# Altium schematic sheet MC1617.SchDoc
size 999 x 599 mm; SheetNumber: 2; SheetTotal: 2; SPICEModelCacheVUJZUAXU: <root> / <DocumentId>VUJZUAXU</DocumentId> / </root>
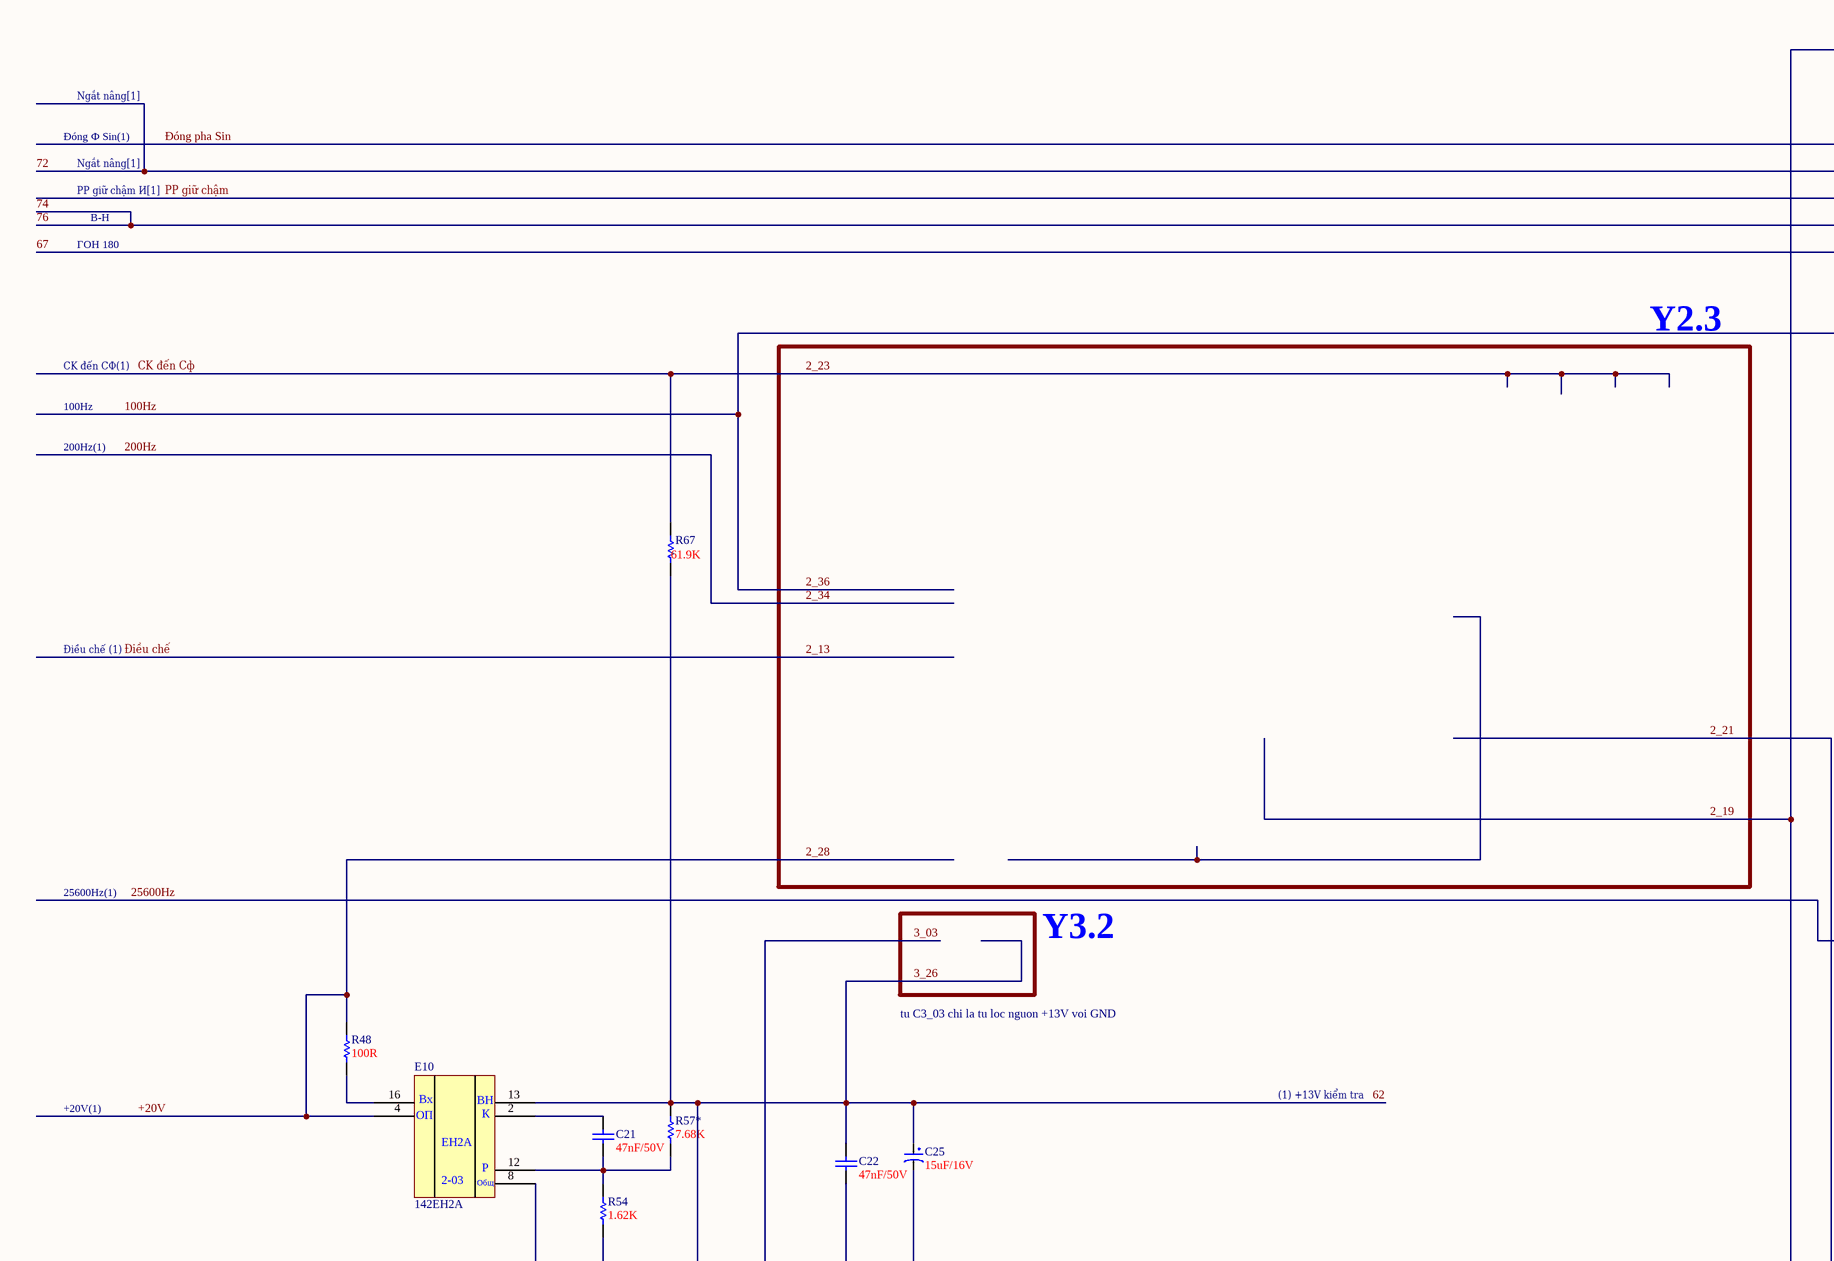
[diagram p0: MC1617.SchDoc, top left]
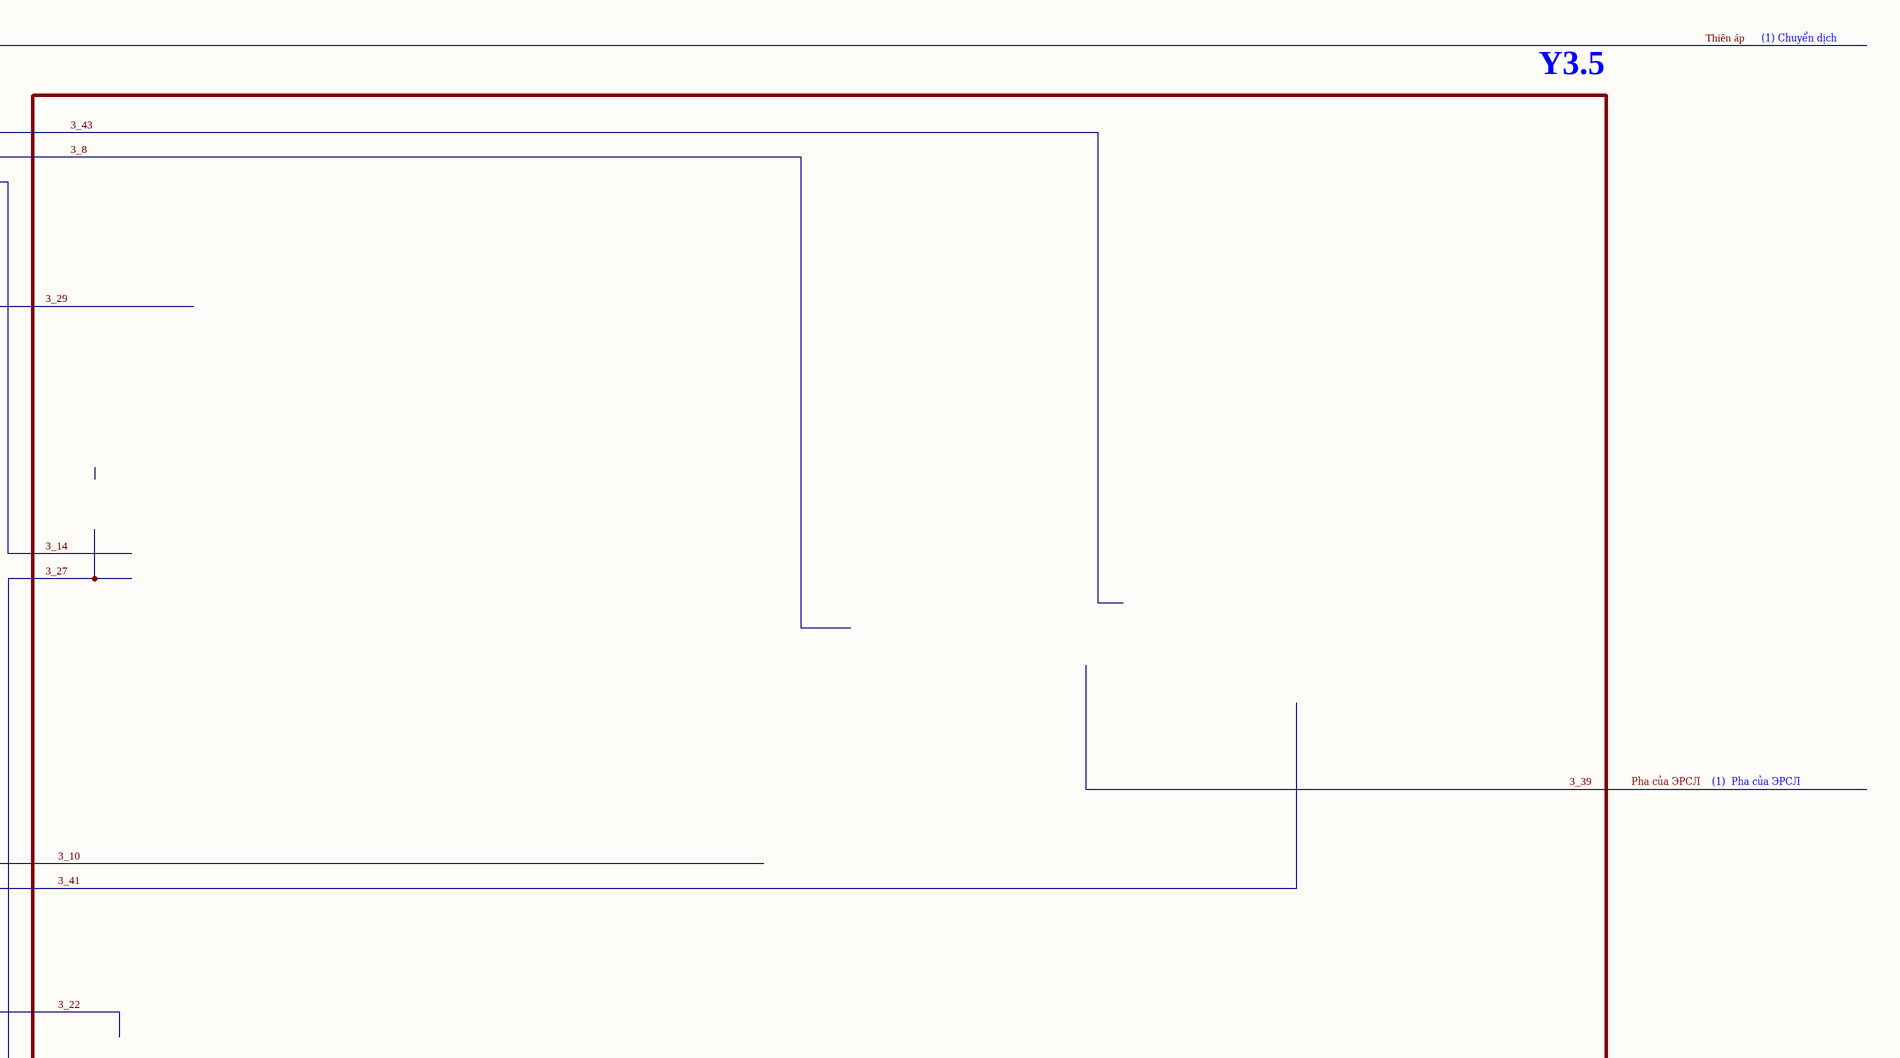
[diagram p1: MC1617.SchDoc, top right]
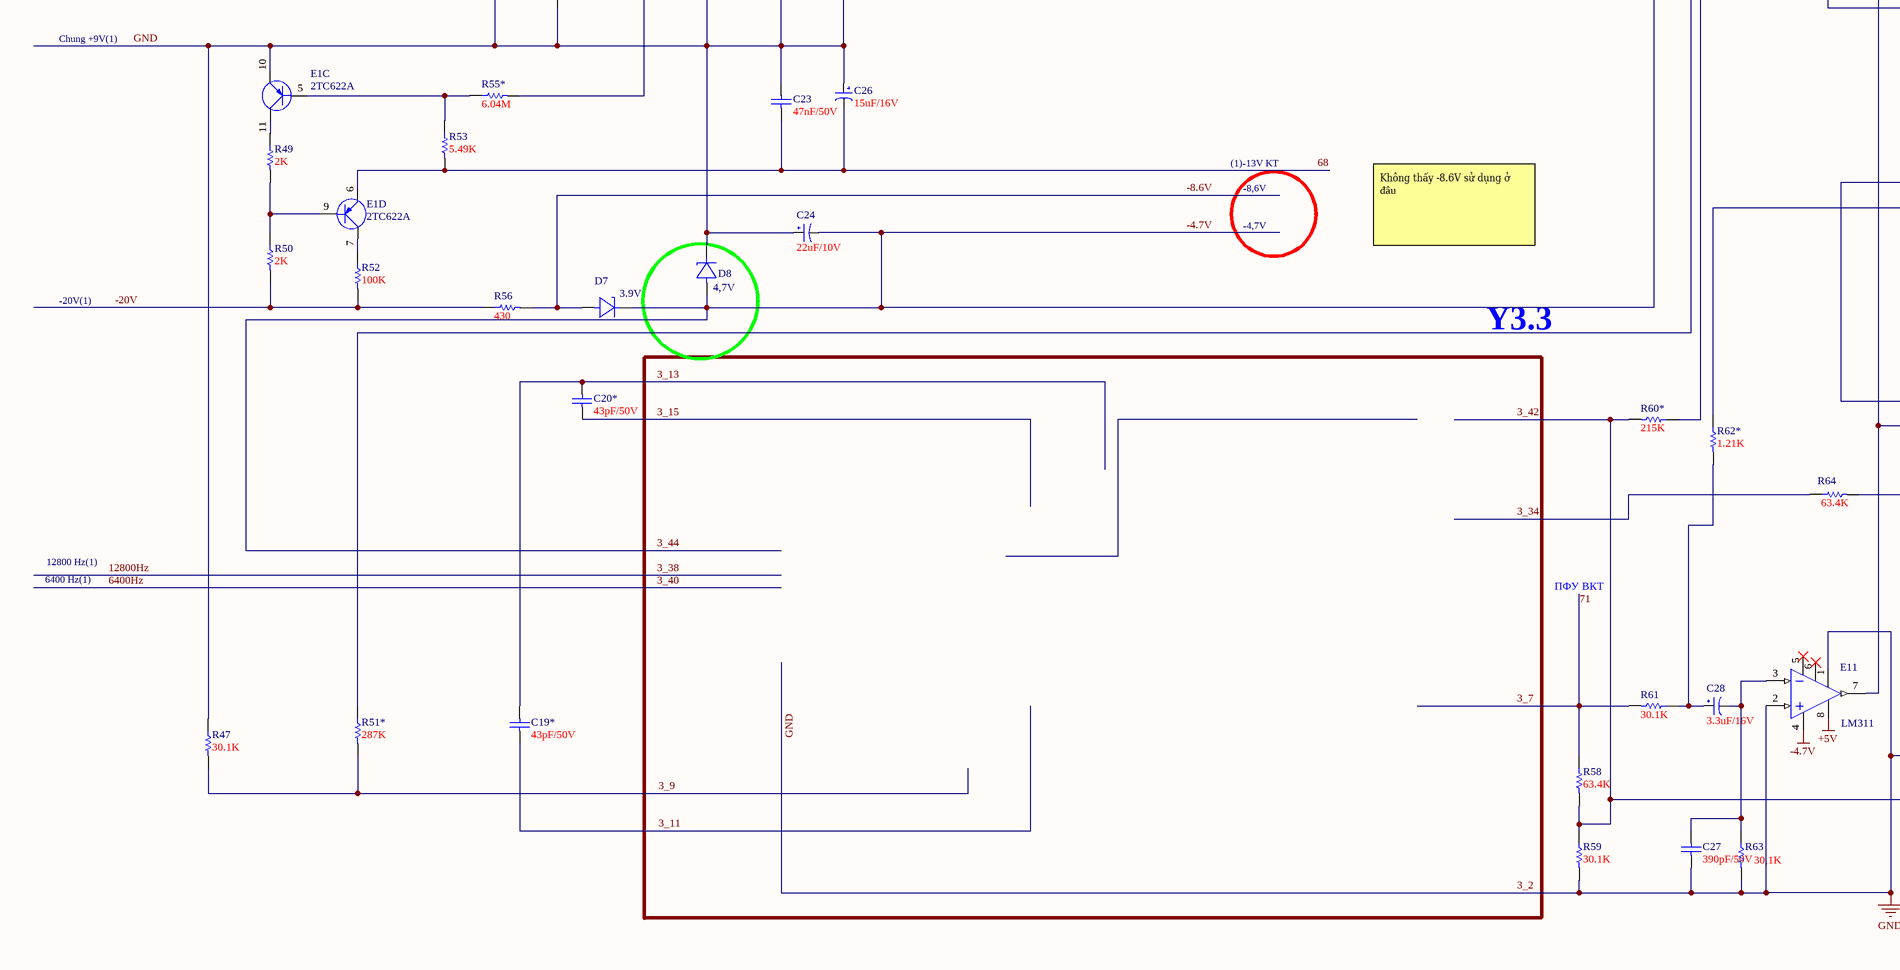
[diagram p2: MC1617.SchDoc, bottom left]
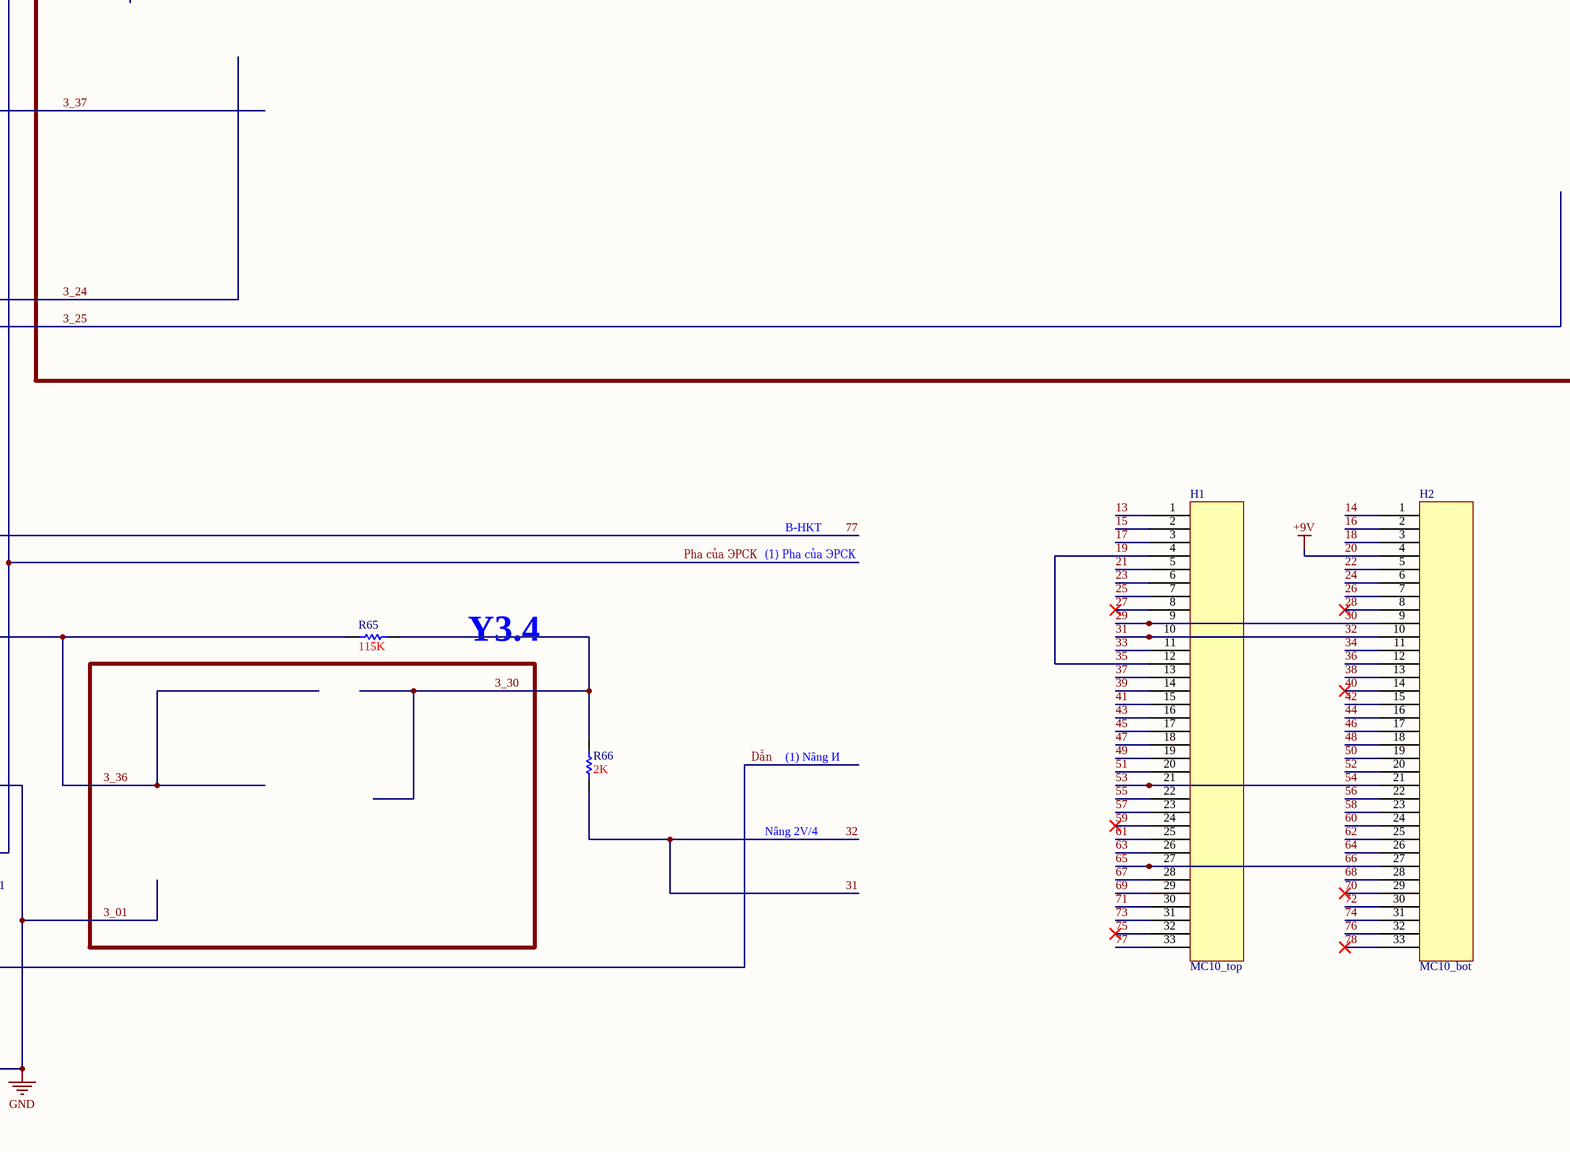
[diagram p3: MC1617.SchDoc, bottom right]

## Parts
C19*  43pF/50V  [C0805]
C20*  43pF/50V  [C0805]
C21  47nF/50V  [C0805]
C22  47nF/50V  [C0805]
C23  47nF/50V  [C0805]
C24  22uF/10V  [C1206]
C25  15uF/16V  [C3528]
C26  15uF/16V  [C3528]
C27  390pF/50V  [C0805]
C28  3.3uF/16V  [C1206]
D7  3.9V  [sod-80]
D8  4,7V  [sod-80]
E1  2ТС622А  [1533LN1]  (parts C,D of 5)
E10  142EH2A  [142EN2A]
E11  LM311  [soic8]
H1  MC10_top  [socket_33p]
H2  MC10_bot  [socket_33p]
R47  30.1K  [r0805]
R48  100R  [res1206]
R49  2K  [r0805]
R50  2K  [r0805]
R51*  287K  [r0805]
R52  100K  [r0805]
R53  5.49K  [r0805]
R54  1.62K  [r0805]
R55*  6.04M  [r0805]
R56  430  [R2512]
R57*  7.68K  [r0805]
R58  63.4K  [r0805]
R59  30.1K  [r0805]
R60*  215K  [r0805]
R61  30.1K  [r0805]
R62*  1.21K  [r0805]
R63  30,1K  [r0805]
R64  63.4K  [r0805]
R65  115K  [r0805]
R66  2K  [r0805]
R67  61.9K  [r0805]

## Nets
3_01: C22.2 C23.1 C24.1 C25.2 C26.1 C27.1 D8.2 E1.10 E10.8 E11.1(COM) E11.2(IN+) R47.1 R54.2 R59.2 R63.2  [also labelled 3_03, 3_2, GND]
20: H2.4  [also labelled +9V]
+5V: E11.8(+V)
-4.7V: C24.2 D7.2 D8.1 E11.4(-V)  [also labelled 2_19, 3_44, Thiên áp]
2_21: R51*.1
2_23: R67.1  [also labelled CK đến Cф]
3_7: H1.30 R58.1 R61.2  [also labelled 71]
3_8: H2.30  [also labelled 72]
3_9: R47.2 R51*.2
3_11: C19*.1
3_13: C19*.2 C20*.2
3_15: C20*.1
3_22: H2.31 H2.32  [also labelled 74, 76]
3_24: H1.33  [also labelled 77]
3_25: R62*.1
3_26: C22.1 C25.1 E10.13 H2.25 R55*.2 R57*.1 R67.2  [also labelled 62]
3_27: E11.7(OUT)  [also labelled Pha của ЭРСК]
3_30: R65.2 R66.2
3_34: R64.1
3_36: R64.2 R65.1
3_37: H1.28  [also labelled 67]
3_41: R60*.1
3_42: R58.2 R59.1 R60*.2  [also labelled Dẫn]
13: H1.1
14: H2.1
15: H1.2
16: H2.2
17: H1.3
18: H2.3
19: H1.4 H1.12  [also labelled 35]
21: H1.5
22: H2.5
23: H1.6
24: H2.6
25: H1.7
26: H2.7
27: H1.8
28: H2.8
29: H1.9 H2.9  [also labelled 30]
31: H1.10 H2.10 R66.1  [also labelled 32]
33: H1.11
34: H2.11
36: H2.12
37: H1.13
38: H2.13
39: H1.14
40: H2.14
41: H1.15
42: H2.15
43: H1.16
44: H2.16
45: H1.17
46: H2.17
47: H1.18
48: H2.18
49: H1.19
50: H2.19
51: H1.20
52: H2.20
53: H1.21 H2.21  [also labelled 54]
55: H1.22
56: H2.22
57: H1.23
58: H2.23
59: H1.24
60: H2.24
61: H1.25
63: H1.26
64: H2.26
65: H1.27 H2.27  [also labelled 66]
68: C23.2 C26.2 E1.6 H2.28 R53.2
69: H1.29
70: H2.29
73: H1.31
75: H1.32
78: H2.33
+20V: E10.4 R48.1  [also labelled 2_28]
-8.6V: D7.1 R56.2
-20V: R50.2 R52.2 R56.1
NetC21_1: C21.1 E10.2
NetC21_2: C21.2 E10.12 R54.1 R57*.2
NetC27_2: C27.2 C28.2 E11.3(IN-) R63.1
NetC28_1: C28.1 R61.1 R62*.2
NetE1_5: E1.5 R53.1 R55*.1
NetE1_7: E1.7 R52.1
NetE1_9: E1.9 R49.2 R50.1
NetE1_11: E1.11 R49.1
NetE10_16: E10.16 R48.2

Not connected (* = marked no-connect by the designer): E11 5* 6*

## Notes on the sheet
- Ngắt nâng[1]
- Y3.5
- (1) Chuyển dịch
- Đóng Ф Sin(1)
- PP giữ chậm И[1]
- В-Н
- ГОН 180
- CK đến CФ(1)
- Y2.3
- 100Hz
- 200Hz(1)
- Điều chế (1)
- 25600Hz(1)
- (1)  Pha của ЭРСЛ
- Y3.2
- tu C3_03 chi la tu loc nguon +13V voi GND
- +20V(1)
- (1) +13V kiểm tra
- Chung +9V(1)
- (1)-13V KT
- -8,6V
- -4,7V
- Không thấy -8.6V sử dụng ở đâu
- -20V(1)
- Y3.3
- (1) Pha của ЭРСК
- B-HKT
- Y3.4
- 6400 Hz(1)
- 12800 Hz(1)
- ПФУ ВКТ
- (1) Nâng И
- Nâng 2V/4
- (in symbol E10-EH2A) Вх; ВН; ОП; К; EH2A; Р; 2-03; Общ

## Library data of the parts
C19* C20* C21-C23 C27 = Cap ceramic: None polar capacitor; ASiD Part Number: C-AS
  C19* C20*: Value: 43pF/50V
  C21-C23: Value: 47nF/50V
  C27: Value: 390pF/50V
C24-C26 C28 = CP2: C 47uF/50V , 220uF/16V; Value: 47uF/16 - 50V; Description 1: 470uF/6,3V - 330uF/10V - 220uF/16V; Description 2: 100uF/25V - 35V - 47uF/50V - 22uF/100V; Description 3: 33uF => 47uF/63V - 1uF => 4,7uF/160V; Description 4: 1uF => 2,2uF/250V - 1uF/350V
D7 D8 = 2С191Ф: Diode Zener
E1 = 2ТС622А: PNP
E10 = E10-EH2A
E11 = 521СА3: OpAmp
H2 = MC10_top
R47-R50 R51* R52-R54 R55* R56 R57* R58 R59 R60* R61 R62* R63-R67 = Res: Standard resistor; ASiD Part Number: Res-AS
  R47 R59 R61: Value: 30.1K
  R48: Value: 100R
  R49 R50 R66: Value: 2K
  R51*: Value: 287K
  R52: Value: 100K
  R53: Value: 5.49K
  R54: Value: 1.62K
  R55*: Value: 6.04M
  R56: Value: 430
  R57*: Value: 7.68K
  R58 R64: Value: 63.4K
  R60*: Value: 215K
  R62*: Value: 1.21K
  R63: Value: 30,1K
  R65: Value: 115K
  R67: Value: 61.9K